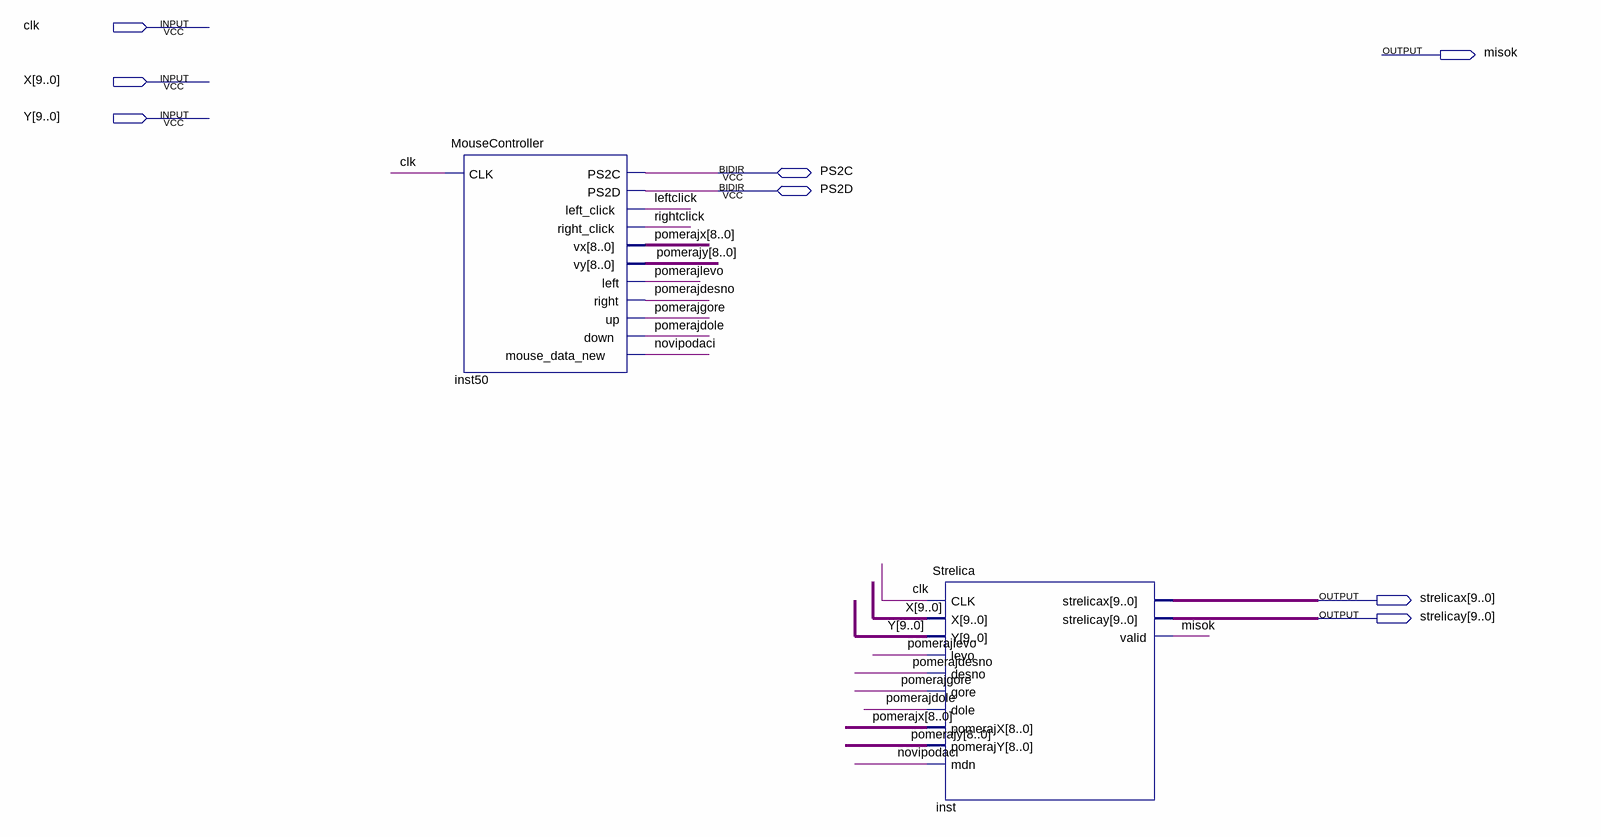
[diagram p0: schematic sheet]
// Quartus schematic pomeranje.bdf as structural Verilog: 2 symbols, 8 pins
module pomeranje (
  input  clk,
  input  [9:0] X,
  input  [9:0] Y,
  inout  PS2C,
  inout  PS2D,
  output misok,
  output [9:0] strelicax,
  output [9:0] strelicay
);

  wire leftclick, novipodaci, pomerajdesno, pomerajdole, pomerajgore, pomerajlevo, rightclick;
  wire [8:0] pomerajx, pomerajy;

  MouseController inst50 (
    .CLK(clk), .left_click(leftclick), .right_click(rightclick), .vx(pomerajx), .vy(pomerajy),
    .left(pomerajlevo), .right(pomerajdesno), .up(pomerajgore), .down(pomerajdole),
    .mouse_data_new(novipodaci), .PS2C(PS2C), .PS2D(PS2D));
  Strelica inst (
    .CLK(clk), .X(X), .Y(Y), .levo(pomerajlevo), .desno(pomerajdesno), .gore(pomerajgore),
    .dole(pomerajdole), .pomerajX(pomerajx), .pomerajY(pomerajy), .mdn(novipodaci), .strelicax(strelicax),
    .strelicay(strelicay), .valid(misok));
endmodule
